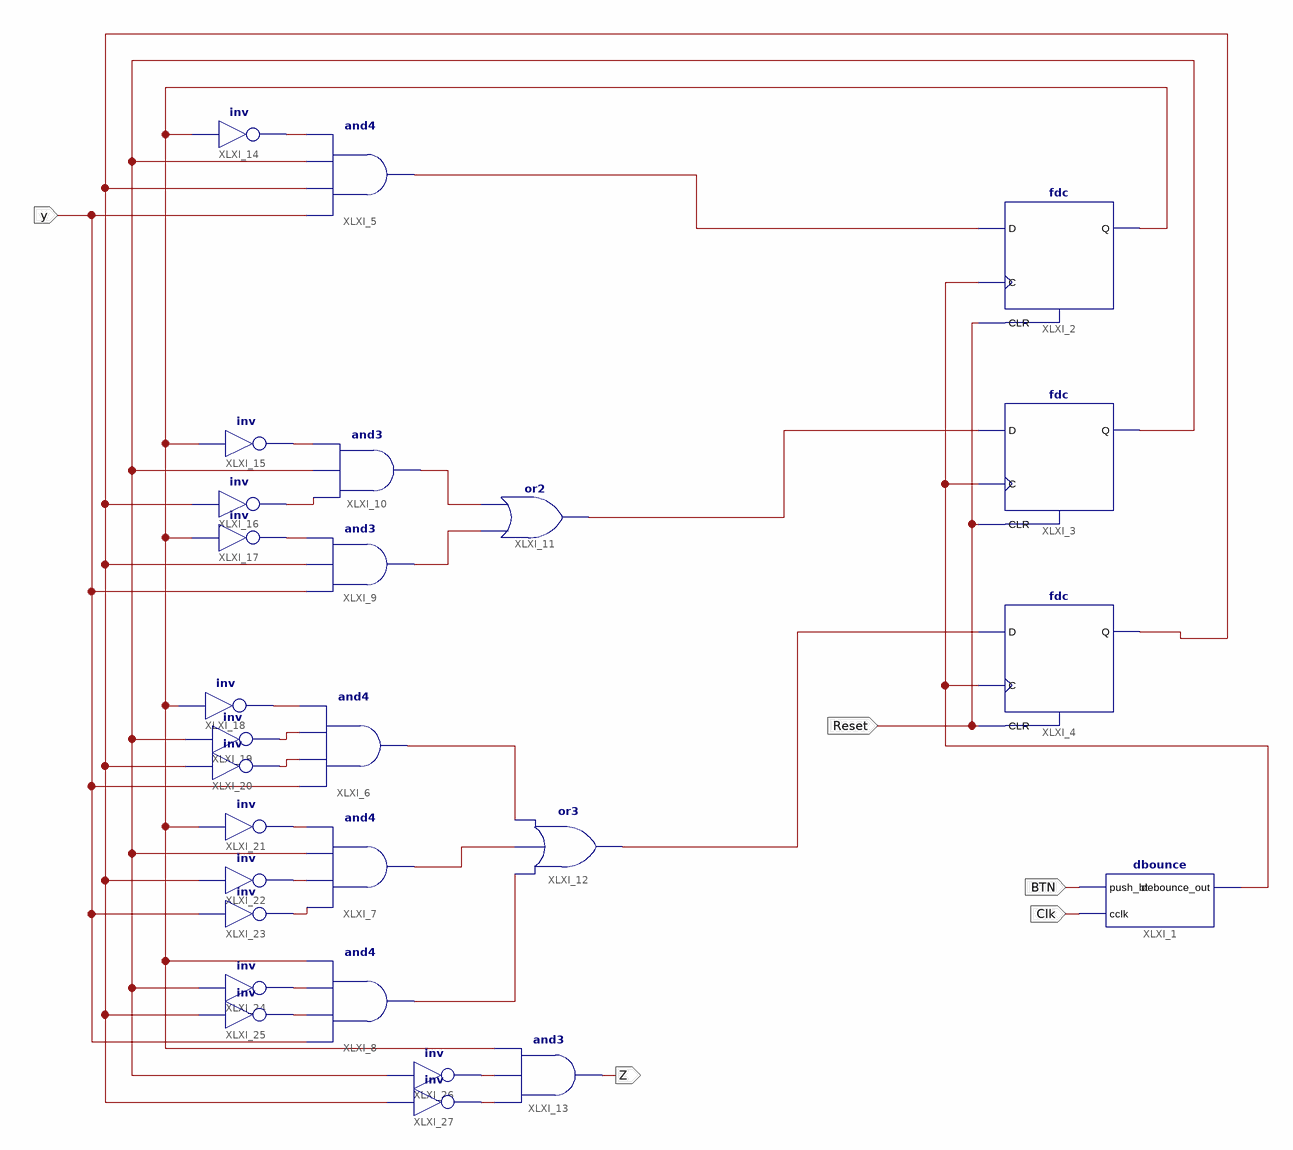
[diagram p0: schematic sheet 1]
// Xilinx ISE schematic sequence_recognizer.sch (spartan6) as structural Verilog: 27 symbols, 5 ports
module sequence_recognizer (
  input  Clk,
  input  BTN,
  input  Reset,
  input  y,
  output Z
);

  wire XLXN_1, XLXN_2, XLXN_3, XLXN_5, XLXN_6, XLXN_7, XLXN_8, XLXN_9, XLXN_15, XLXN_37, XLXN_44, XLXN_45,
       XLXN_54, XLXN_60, XLXN_61, XLXN_62, XLXN_63, XLXN_64, XLXN_65, XLXN_66, XLXN_67, XLXN_70, XLXN_71,
       XLXN_72, XLXN_73, XLXN_74;

  dbounce XLXI_1 (.push_bt(BTN), .cclk(Clk), .debounce_out(XLXN_15));
  fdc XLXI_2 (.C(XLXN_15), .CLR(Reset), .D(XLXN_7), .Q(XLXN_37));
  fdc XLXI_3 (.C(XLXN_15), .CLR(Reset), .D(XLXN_8), .Q(XLXN_45));
  fdc XLXI_4 (.C(XLXN_15), .CLR(Reset), .D(XLXN_9), .Q(XLXN_54));
  and XLXI_5 (XLXN_7, y, XLXN_54, XLXN_45, XLXN_44);
  and XLXI_6 (XLXN_3, y, XLXN_67, XLXN_73, XLXN_74);
  and XLXI_7 (XLXN_2, XLXN_66, XLXN_64, XLXN_45, XLXN_65);
  and XLXI_8 (XLXN_1, y, XLXN_62, XLXN_63, XLXN_37);
  and XLXI_9 (XLXN_6, y, XLXN_54, XLXN_70);
  and XLXI_10 (XLXN_5, XLXN_71, XLXN_45, XLXN_72);
  or XLXI_11 (XLXN_8, XLXN_6, XLXN_5);
  or XLXI_12 (XLXN_9, XLXN_1, XLXN_2, XLXN_3);
  and XLXI_13 (Z, XLXN_60, XLXN_61, XLXN_37);
  not XLXI_14 (XLXN_44, XLXN_37);
  not XLXI_15 (XLXN_72, XLXN_37);
  not XLXI_16 (XLXN_71, XLXN_54);
  not XLXI_17 (XLXN_70, XLXN_37);
  not XLXI_18 (XLXN_74, XLXN_37);
  not XLXI_19 (XLXN_73, XLXN_45);
  not XLXI_20 (XLXN_67, XLXN_54);
  not XLXI_21 (XLXN_65, XLXN_37);
  not XLXI_22 (XLXN_64, XLXN_54);
  not XLXI_23 (XLXN_66, y);
  not XLXI_24 (XLXN_63, XLXN_45);
  not XLXI_25 (XLXN_62, XLXN_54);
  not XLXI_26 (XLXN_61, XLXN_45);
  not XLXI_27 (XLXN_60, XLXN_54);
endmodule
